# EAGLE schematic LM1117-adj_power_supply (EAGLE 7.6.0)
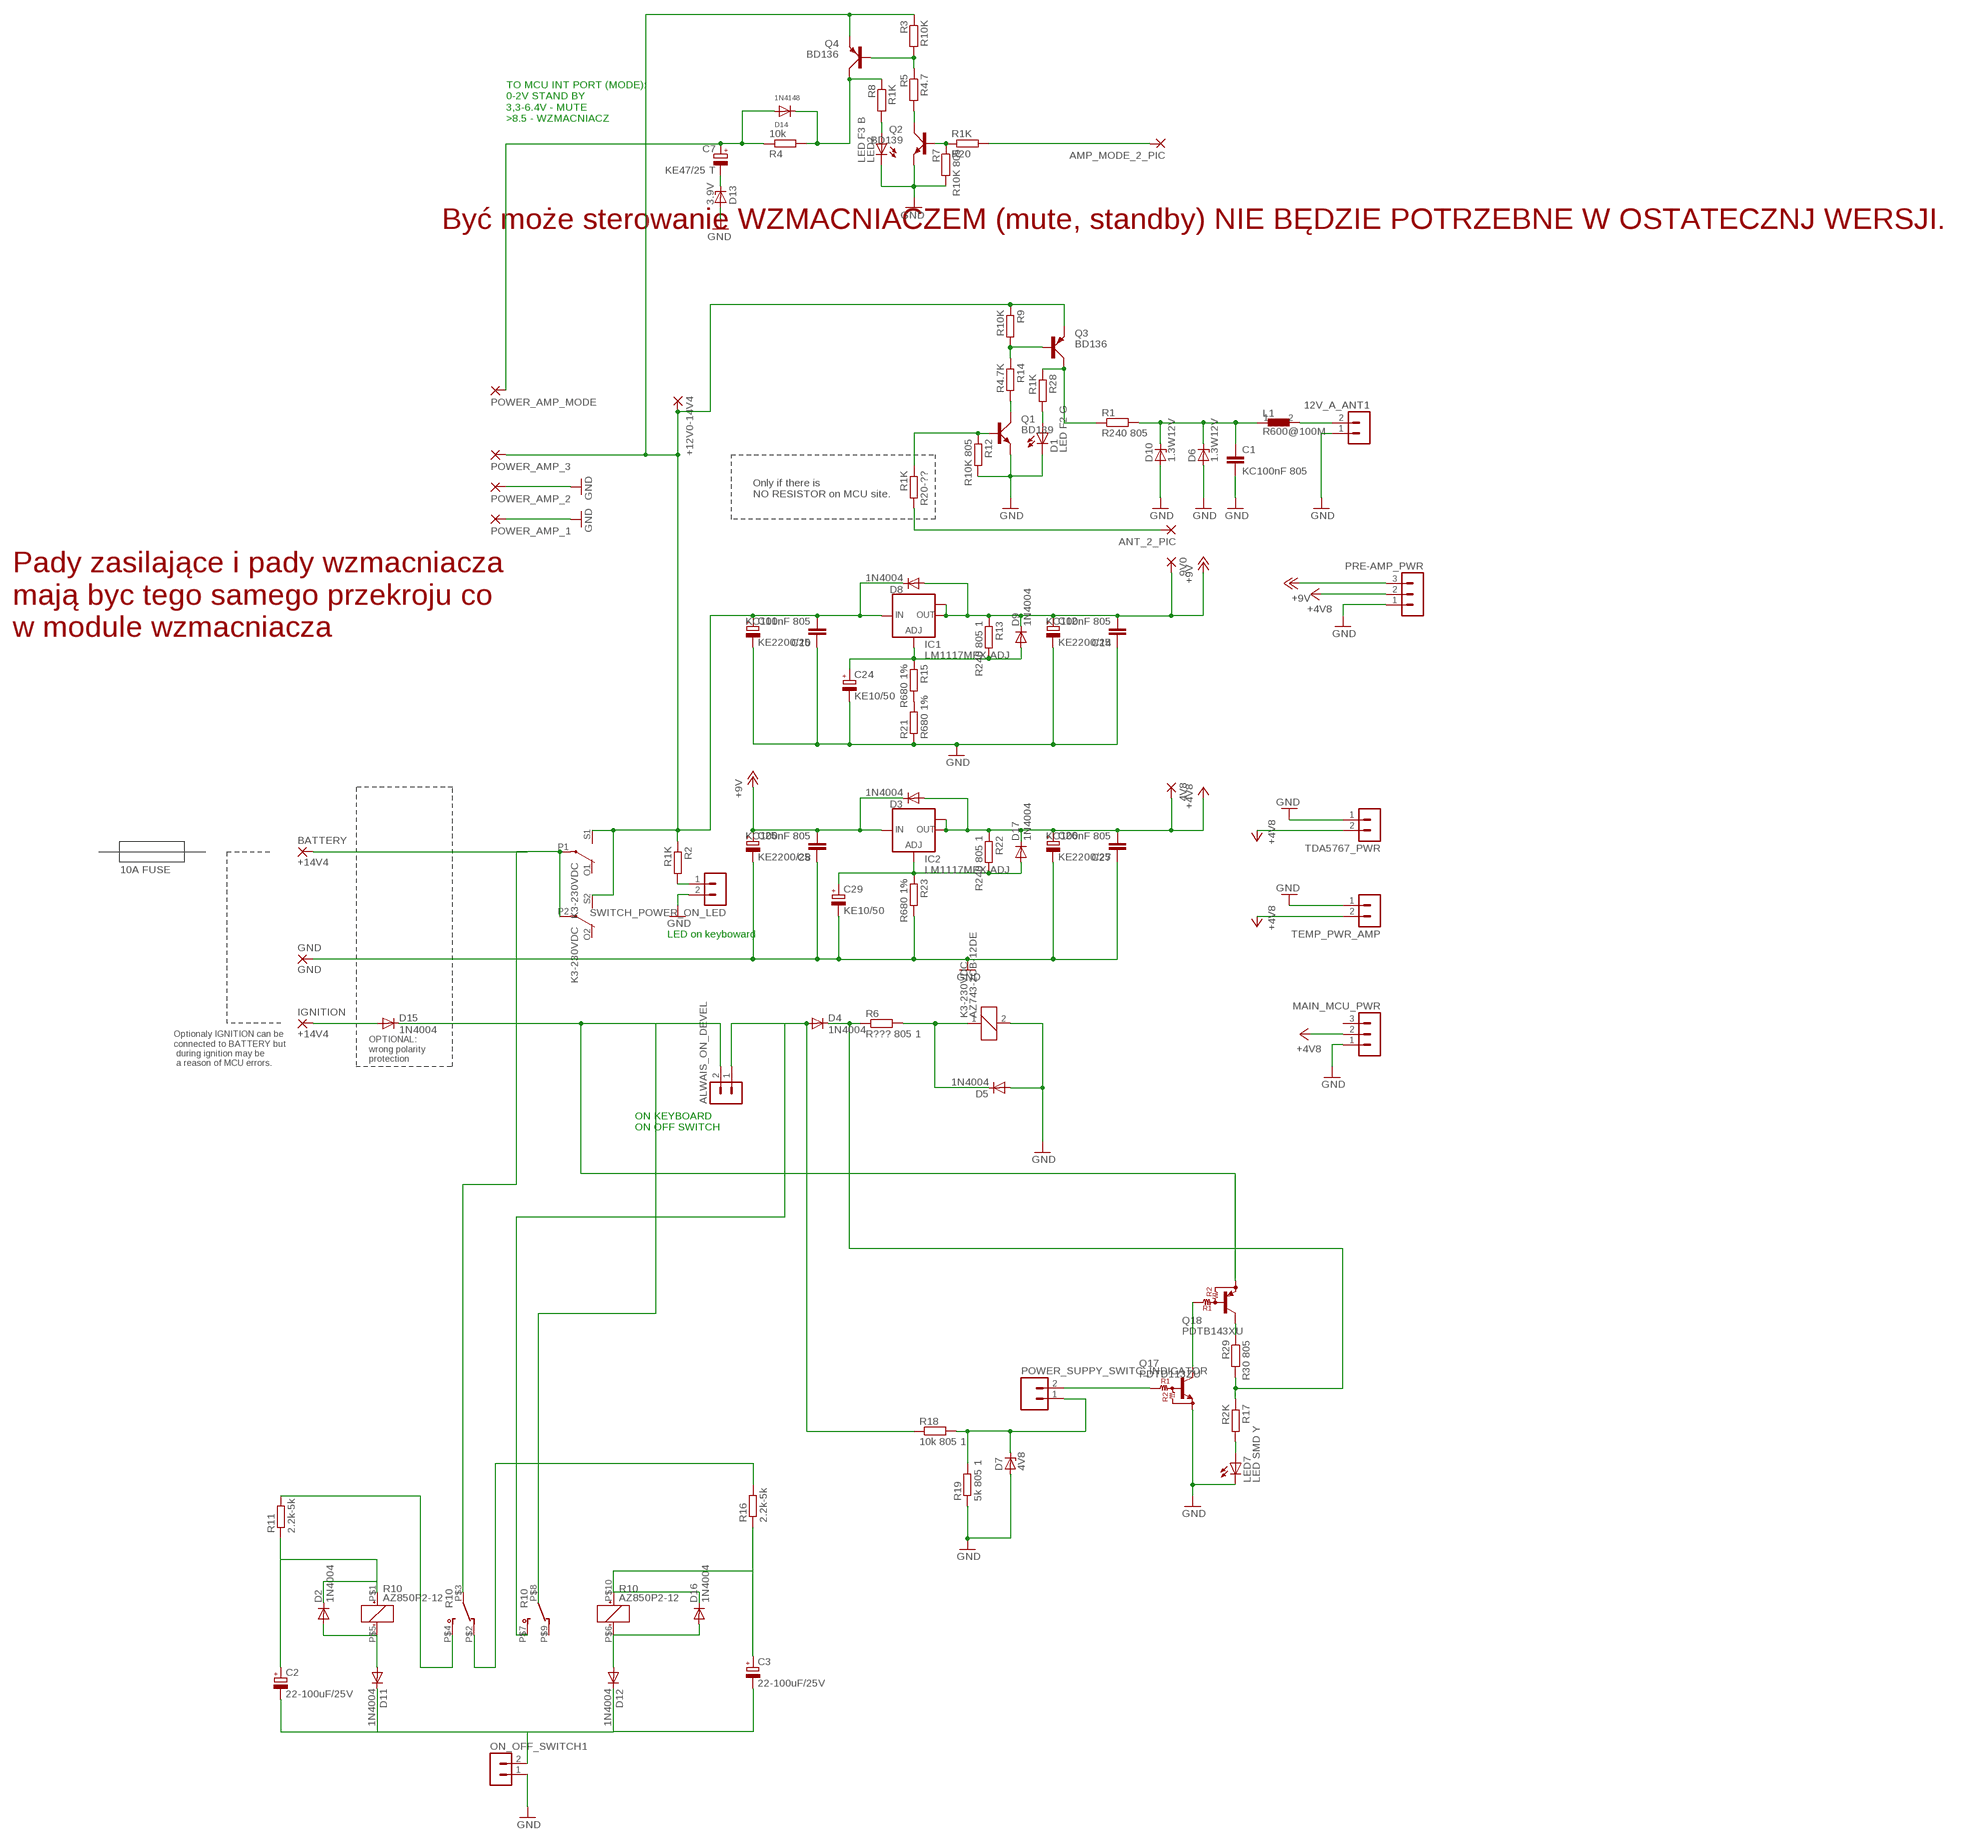
[diagram p0: schematic, sheet 1]

## Parts
4V8  3,17/1,3  [3,17/1,3]
9V0  3,17/1,3  [3,17/1,3]
12V_A_ANT1  MA02-1  [MA02-1]
+12V0-14V4  3,17/1,3  [3,17/1,3]
ALWAIS_ON_DEVEL  MA02-1  [MA02-1]
AMP_MODE_2_PIC  1,6/0,8  [1,6/0,8]
ANT_2_PIC  1,6/0,8  [1,6/0,8]
BATTERY  +14V4  3,81/1,3  [3,81/1,3]
C1  KC100nF 805  C-EUC0805  [C0805]
C2  22-100uF/25V  CPOL-EUE2,5-6E  [E2,5-6E]
C3  22-100uF/25V  CPOL-EUE2,5-6E  [E2,5-6E]
C7  KE47/25 T  CPOL-EUB45181A  [B45181A]
C8  KC100nF 805  C-EUC0805  [C0805]
C10  KC100nF 805  C-EUC0805  [C0805]
C11  KE2200/25  CPOL-EUE5-10.5  [E5-10,5]
C12  KE2200/25  CPOL-EUE5-10.5  [E5-10,5]
C14  KC100nF 805  C-EUC0805  [C0805]
C24  KE10/50  CPOL-EUTT2D4  [TT2D4]
C25  KE2200/25  CPOL-EUE5-10.5  [E5-10,5]
C26  KE2200/25  CPOL-EUE5-10.5  [E5-10,5]
C27  KC100nF 805  C-EUC0805  [C0805]
C29  KE10/50  CPOL-EUTT2D4  [TT2D4]
D1  LED F2 G  SFH482  [SFH482]
D2  1N4004  1N4004DO41-7.6  [DO41-7.6]
D3  1N4004  1N4004DO41-7.6  [DO41-7.6]
D4  1N4004  1N4004DO41-7.6  [DO41-7.6]
D5  1N4004  1N4004DO41-7.6  [DO41-7.6]
D6  1.3W12V  ZENER-DIODEZD-2.5  [ZDIO-2.5]
D7  4V8  ZENER-DIODEZD-2.5  [ZDIO-2.5]
D8  1N4004  1N4004DO41-7.6  [DO41-7.6]
D9  1N4004  1N4004DO41-7.6  [DO41-7.6]
D10  1.3W12V  ZENER-DIODEZD-2.5  [ZDIO-2.5]
D11  1N4004  1N4004DO41-7.6  [DO41-7.6]
D12  1N4004  1N4004DO41-7.6  [DO41-7.6]
D13  3.9V  ZENER-DIODEZD-5  [ZDIO-5]
D14  1N4148  DIODEDO-1N4148  [DO-1N4148]
D15  1N4004  1N4004DO41-7.6  [DO41-7.6]
D16  1N4004  1N4004DO41-7.6  [DO41-7.6]
D17  1N4004  1N4004DO41-7.6  [DO41-7.6]
GND  GND  3,81/1,3  [3,81/1,3]
IC1  LM1117MPX-ADJ  [SOT223]
IC2  LM1117MPX-ADJ  [SOT223]
IGNITION  +14V4  3,81/1,3  [3,81/1,3]
K3-230VDC  AZ743-2CB-12DE  G2R2  [G2R2]
L1  R600@100M  FERRITR0805  [R0805]
LED2  LED F3 B  LED3MM  [LED3MM]
LED7  LED SMD Y  LED  [SMARTLED-TTW]
MAIN_MCU_PWR  MA03-1  [MA03-1]
ON_OFF_SWITCH1  MA02-1  [MA02-1]
POWER_AMP_1  3,17/1,3  [3,17/1,3]
POWER_AMP_2  3,17/1,3  [3,17/1,3]
POWER_AMP_3  3,17/1,3  [3,17/1,3]
POWER_AMP_MODE  3,17/1,3  [3,17/1,3]
POWER_SUPPY_SWITC_INDICATOR  MA02  [02PA]
PRE-AMP_PWR  MA03-1  [MA03-1]
Q1  BD139  [TO126AV]
Q2  BD139  [TO126AV]
Q3  BD136  BD140  [TO126AV]
Q4  BD136  BD140  [TO126AV]
Q17  PDTD113ZU  [SOT-23]
Q18  PDTB143XU  [SOT-23]
R1  R240 805  R-EU_M0805  [M0805]
R2  R1K  R-EU_R0805  [R0805]
R3  R10K  R-EU_0204/5  [0204/5]
R4  10k  R-EU_0204/2V  [0204V]
R5  R4.7  R-EU_0204/5  [0204/5]
R6  R??? 805 1  R-EU_M0805  [M0805]
R7  R10K 805  R-EU_R0805  [R0805]
R8  R1K  R-EU_0204/5  [0204/5]
R9  R10K  R-EU_0204/5  [0204/5]
R10  AZ850P2-12  [AZ850-2C]
R11  2.2k-5k  R-EU_0204/5  [0204/5]
R12  R10K 805  R-EU_R0805  [R0805]
R13  R240 805 1  R-EU_M0805  [M0805]
R14  R4.7K  R-EU_0204/5  [0204/5]
R15  R680 1%  R-EU_0204/2V  [0204V]
R16  2.2k-5k  R-EU_0204/5  [0204/5]
R17  R2K  R-EU_R0805  [R0805]
R18  10k 805 1  R-EU_M0805  [M0805]
R19  5k 805 1  R-EU_M0805  [M0805]
R20  R1K  R-EU_0204/5  [0204/5]
R20-??  R1K  R-EU_0204/5  [0204/5]
R21  R680 1%  R-EU_0204/2V  [0204V]
R22  R240 805 1  R-EU_M0805  [M0805]
R23  R680 1%  R-EU_0204/2V  [0204V]
R28  R1K  R-EU_0204/5  [0204/5]
R29  R30 805  R-EU_R0805  [R0805]
SWITCH_POWER_ON_LED  MA02-1  [MA02-1]
TDA5767_PWR  MA02-1  [MA02-1]
TEMP_PWR_AMP  MA02-1  [MA02-1]

## Nets
+4V8: 4V8.1(P) C26.+ C27.2 D3.A D17.C IC2.2(OUT) IC2.TAB(OUT1) MAIN_MCU_PWR.2 PRE-AMP_PWR.2 R22.1 TDA5767_PWR.2 TEMP_PWR_AMP.2
+9V0: 9V0.1(P) C8.2 C12.+ C14.2 C25.+ D3.C D8.A D9.C IC1.2(OUT) IC1.TAB(OUT1) IC2.3(IN) PRE-AMP_PWR.3 R13.1 ; supply symbol labelled +9V
+14.4V: +12V0-14V4.1(P) C10.2 C11.+ D8.C IC1.3(IN) K3-230VDC.S1(2:S) K3-230VDC.S2(3:S) POWER_AMP_3.1(P) Q3.E Q4.E R2.1 R3.1 R9.1
AMP_MODE: AMP_MODE_2_PIC.1(P) R20.2
GND: 12V_A_ANT1.1 C1.2 C8.1 C10.1 C11.- C12.- C14.1 C24.- C25.- C26.- C27.1 C29.- D1.K(C) D5.A D6.A D7.A D10.A D13.A GND.1(P) K3-230VDC.2 LED2.K(C) LED7.C@1(C) MAIN_MCU_PWR.1 ON_OFF_SWITCH1.1 POWER_AMP_1.1(P) POWER_AMP_2.1(P) PRE-AMP_PWR.1 Q1.E Q2.E Q17.2(E) R7.2 R12.2 R19.1 R21.1 R23.2 SWITCH_POWER_ON_LED.2 TDA5767_PWR.1 TEMP_PWR_AMP.1
MCLR_SUPPLY: ALWAIS_ON_DEVEL.1 D4.A R10.P$7 R18.1
MCLR_SUPPLY1: ALWAIS_ON_DEVEL.2 D15.C Q18.2(E)
N$1: ANT_2_PIC.1(P) R20-??.2
N$2: C24.+ D9.A IC1.1(ADJ) R13.2 R15.1
N$3: R15.2 R21.2
N$4: D2.A D11.A R10.P$5(S$1:-)
N$5: Q17.3(C) Q18.1(B)
N$6: BATTERY.1(P) K3-230VDC.P1(2:P) K3-230VDC.P2(3:P) R10.P$3
N$7: Q3.C R1.1 R28.1
N$8: D5.C K3-230VDC.1 R6.2
N$9: R2.2 SWITCH_POWER_ON_LED.1
N$10: D14.C Q4.C R4.2 R8.1
N$11: D4.C R6.1 R17.1 R29.2
N$12: LED7.A@1(A) R17.2
N$13: D15.A IGNITION.1(P)
N$14: C2.+ D2.C R10.P$1(S$1:+) R11.1
N$16: C3.+ D16.C R10.P$10(R$2:+) R16.1
N$18: Q1.B R12.1 R20-??.1
N$19: Q1.C R14.2
N$20: C2.- C3.- D11.C D12.C ON_OFF_SWITCH1.2
N$21: C7.- D13.C
N$23: C7.+ D14.A POWER_AMP_MODE.1(P) R4.1
N$24: D12.A D16.A R10.P$6(R$2:-)
N$25: Q3.B R9.2 R14.1
N$26: C1.1 D6.C D10.C L1.1 R1.2
N$27: C29.+ D17.A IC2.1(ADJ) R22.2 R23.1
N$30: R10.P$4 R11.2
N$31: R10.P$2 R16.2
N$33: 12V_A_ANT1.2 L1.2
N$35: Q18.3(C) R29.1
N$40: D1.A R28.2
N$47: Q2.B R7.1 R20.1
N$48: Q2.C R5.2
N$49: Q4.B R3.2 R5.1
N$52: LED2.A R8.2
PS_RELAY_SUSTAIN: POWER_SUPPY_SWITC_INDICATOR.2 Q17.1(B)
PS_SWITCH_ON_OFF: D7.C POWER_SUPPY_SWITC_INDICATOR.1 R18.2 R19.2
Unconnected: K3-230VDC.O1(2:O) K3-230VDC.O2(3:O) MAIN_MCU_PWR.3 R10.P$8 R10.P$9

## Notes on the sheet
- TO MCU INT PORT (MODE): 
  0-2V STAND BY
  3,3-6.4V - MUTE
  >8.5 - WZMACNIACZ
- Być może sterowanie WZMACNIACZEM (mute, standby) NIE BĘDZIE POTRZEBNE W OSTATECZNJ WERSJI.
- Only if there is
  NO RESISTOR on MCU site.
- Pady zasilające i pady wzmacniacza
  mają byc tego samego przekroju co
  w module wzmacniacza
- 10A FUSE
- LED on keyboward
- OPTIONAL:
  wrong polarity
  protection
- Optionaly IGNITION can be
  connected to BATTERY but
   during ignition may be
   a reason of MCU errors.
- ON KEYBOARD
  ON OFF SWITCH

## Library data of the parts
4V8 9V0 +12V0-14V4 POWER_AMP_1-POWER_AMP_3 POWER_AMP_MODE = wirepad:3,17/1,3: THROUGH-HOLE PAD
12V_A_ANT1 ALWAIS_ON_DEVEL ON_OFF_SWITCH1 SWITCH_POWER_ON_LED TDA5767_PWR TEMP_PWR_AMP = con-lstb_SileliS:MA02-1: PIN HEADER
AMP_MODE_2_PIC ANT_2_PIC = wirepad:1,6/0,8: THROUGH-HOLE PAD
BATTERY GND IGNITION = wirepad:3,81/1,3: THROUGH-HOLE PAD
C1 C8 C10 C14 C27 = rcl:C-EU: CAPACITOR, European symbol
C2 C3 = resistor:CPOL-EU: POLARIZED CAPACITOR, European symbol
C7 C11 C12 C24-C26 C29 = rcl:CPOL-EU: POLARIZED CAPACITOR, European symbol
D1 = led:SFH482: IR LED infrared emitting diode, Infineon
D2-D5 D8 D9 D11 D12 D15-D17 = diode_SileliS:1N4004: DIODE general purpose rectifier, 1 A
D6 D10 D13 = diode:ZENER-DIODE: Z-Diode
D7 = diode_SileliS:ZENER-DIODE: Z-Diode
D14 = adafruit:DIODE: Diode SMADIODE - SMA Surface Mount Package 20V 1A Schottky Diode Digikey: 641-1014-6-ND DO-1N4148 - Through Hole Small Current Diode SOD-123 20V 1 A (.5mV Vf) Schottky Diode - Digikey: MBRX120TPMSCT-ND SOD-323 10V 570mA (.38mV Vf, 3ns) Schottky Diode - Digikey: ZLLS410CT-ND SOD-523 30V 30mA Schottky Diode (RB751S-40TE61) - Digikey: RB751S-40TE61CT-ND SOT23-R/W - SOT23 Package (R = Solder Paste/Reflow Ovens, W = Hand-Soldering) BAT54Film 40V 300mA - Digikey: 497-7162-1-ND
IC1 IC2 = lm1117:LM1117MPX-ADJ
K3-230VDC = relay:G2R2: RELAY 2 x switch, Omron; MF: OMRON COMPONENTS USA; MPN: G2R-2-DC6; OC_FARNELL: unknown; OC_NEWARK: 89C5317
L1 = ferrit_bear:FERRIT
LED2 = led:LED: LED
LED7 = adafruit:LED: LED
MAIN_MCU_PWR PRE-AMP_PWR = con-lstb_SileliS:MA03-1: PIN HEADER; OC_FARNELL: unknown; OC_NEWARK: unknown
POWER_SUPPY_SWITC_INDICATOR = con-amp-quick:MA02: AMP QUICK CONNECTOR; OC_FARNELL: unknown; OC_NEWARK: unknown
Q1 Q2 = transistor-power:BD139: NPN TRANSISTOR
Q3 Q4 = transistor-power:BD140: PNP TRANSISTOR
Q17 = pre-bias-transistor:PDTD: Pre biase NPN transistor NPN Resistor-Equipped Transistor (RET) family in a very small SOT323 (SC-70) Surface-Mounted Device (SMD) plastic package. VCC = 50V Ic (max) = 500 mA; R1: 1 kOhm; R2: 10 kOhm
Q18 = pre-bias-transistor:PDTB: PNP Resistor-Equipped Transistor (RET) family in a very small SOT323 (SC-70) Surface-Mounted Device (SMD) plastic package. VCC = -50 IC (max) = -500mA; R1: 4.7 kOhm; R2: 10 kOhm
R1-R9 R12-R15 R17-R20 R20-?? R21-R23 R28 R29 = rcl:R-EU_: RESISTOR, European symbol
R10 = relay_silelis:AZ850P2-12
R11 R16 = resistor:R-EU_: RESISTOR, European symbol